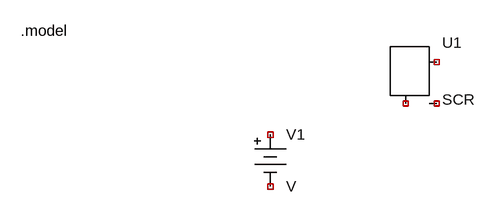
[diagram p0: schematic coilgun7.asc]
coilgun7.asc, the LTspice schematic file:
Version 4.1
SHEET 1 880 680
SYMBOL Misc\\battery 128 128 R0
SYMATTR InstName V1
SYMBOL Misc\\SCR 368 32 R0
SYMATTR InstName U1
TEXT -256 -16 Left 2 !.model

The netlist it stands for:
* coilgun7.asc
V1 NC_01 NC_02 V
* U1: SCR (symbol Misc\SCR not certain, pin order unknown); nets seen at it: 
.model
.backanno
.end